# Altium schematic sheet blocks.SchDoc
size A3; Email: soliva@seaos.co.jp; Rule: PcbType=ProtelPcb
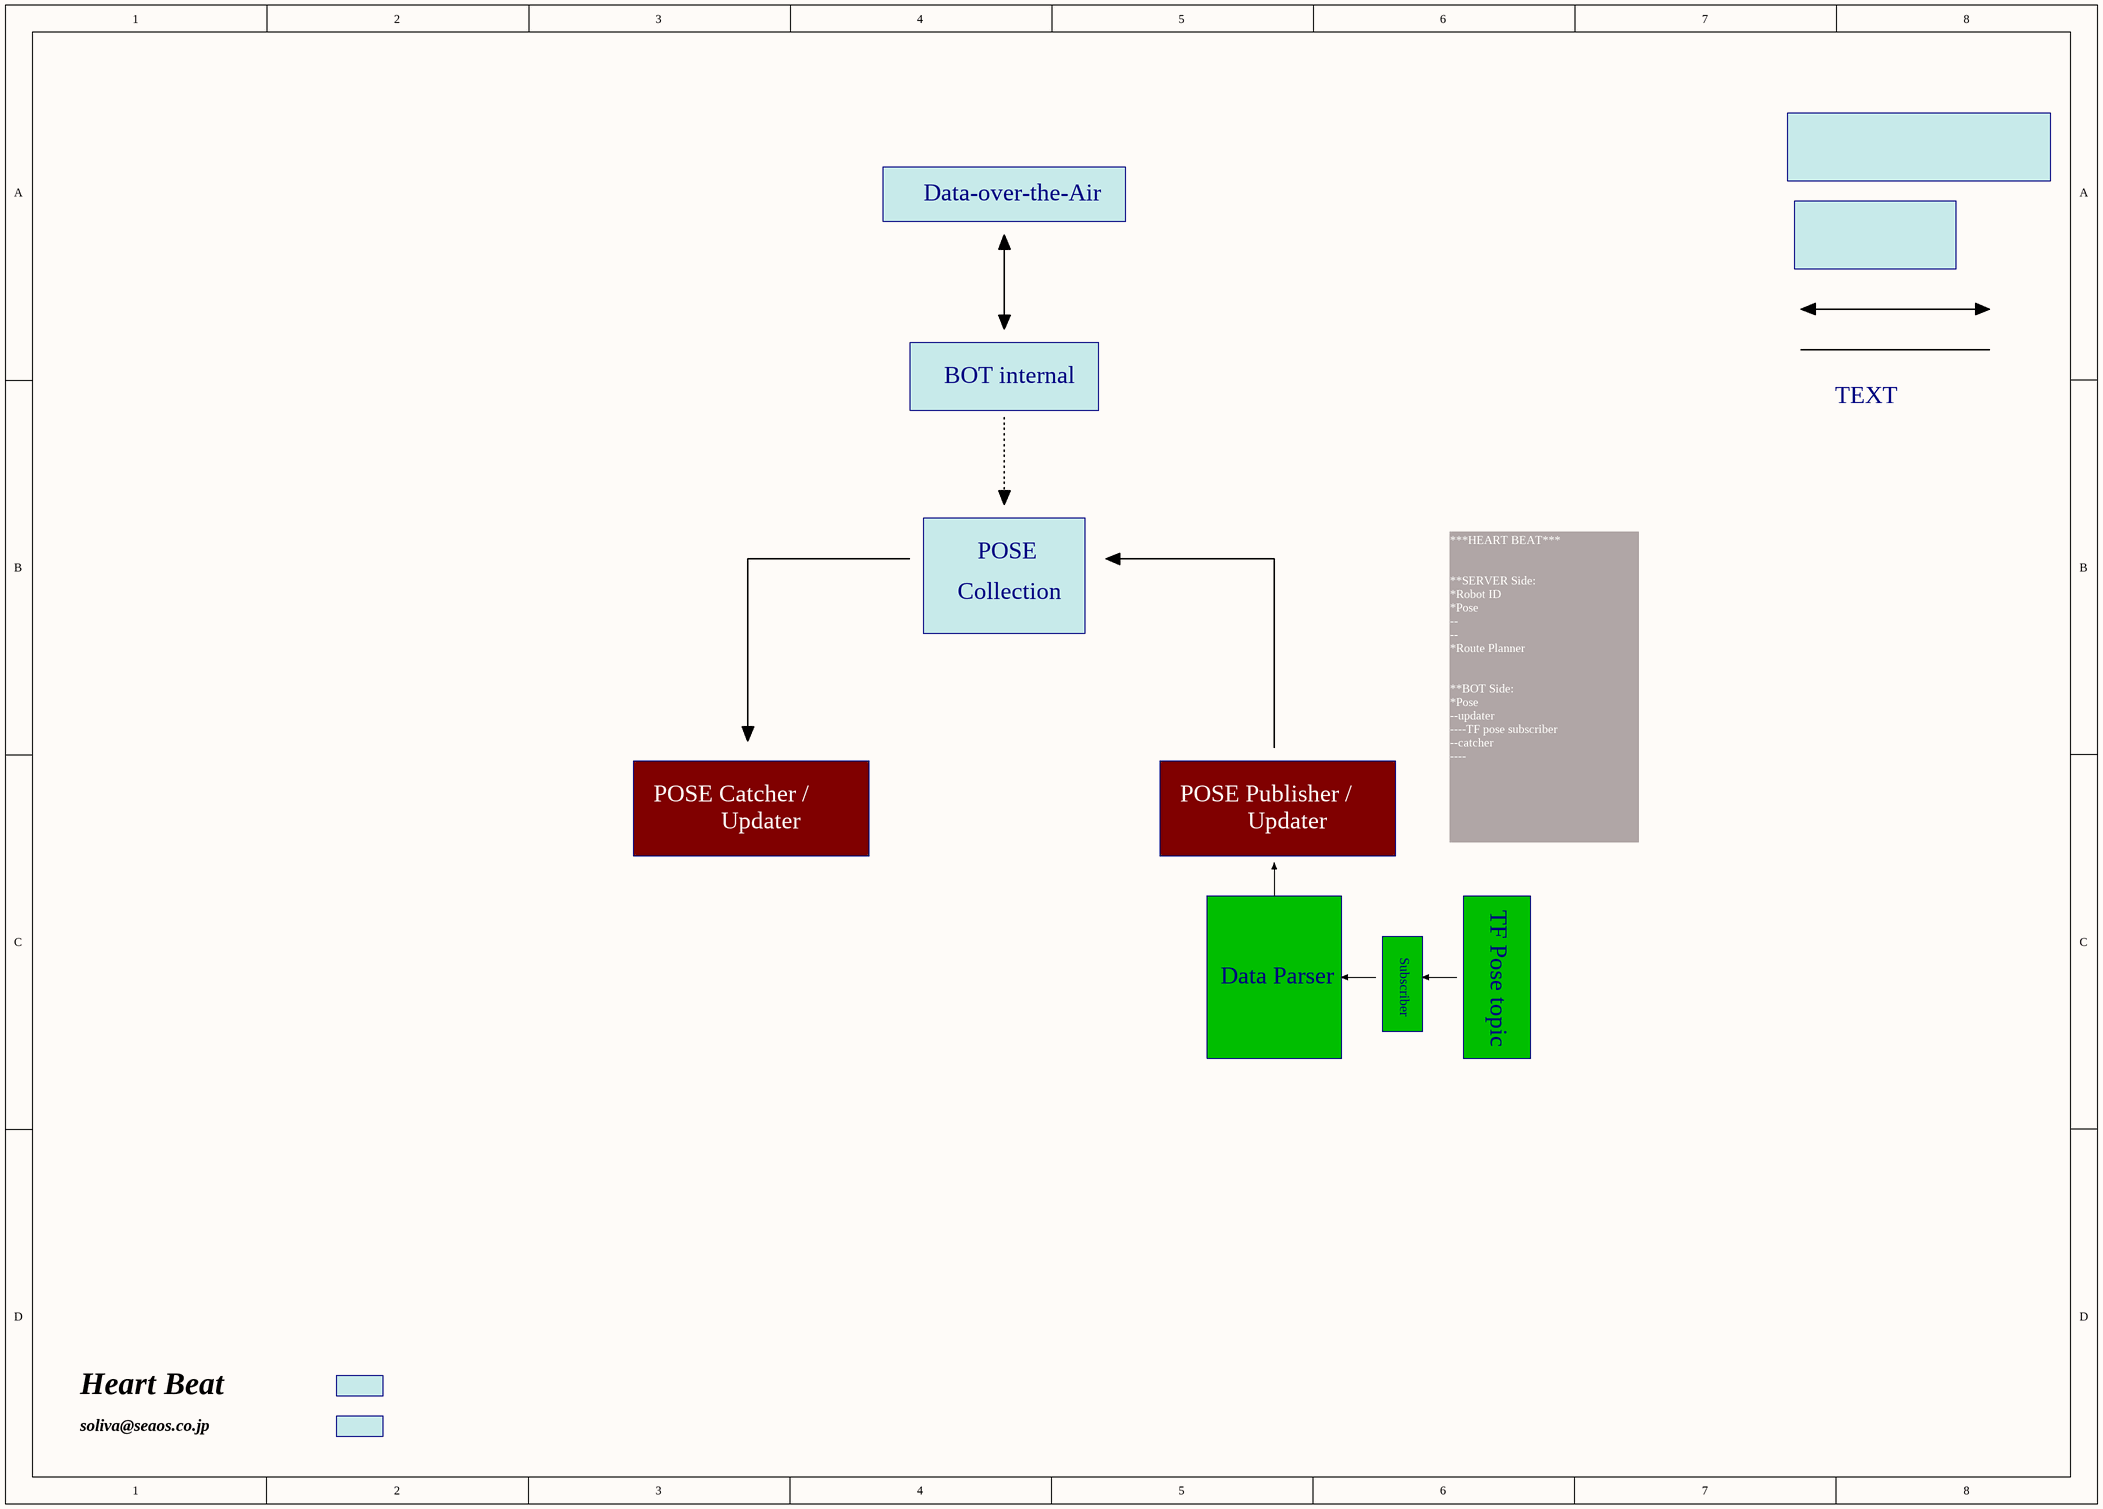
[diagram p0: blocks.SchDoc]

## Notes on the sheet
- Data-over-the-Air
- BOT internal
- TEXT
- POSE
- Collection
- POSE Catcher /
- Updater
- POSE Publisher /
- ***HEART BEAT***
  **SERVER Side:
  *Robot ID
  *Pose
  --
  --
  *Route Planner
  **BOT Side:
  *Pose
  --updater
  ----TF pose subscriber
  --catcher
  ----
- TF Pose topic
- Data Parser
- Subscriber
- Heart Beat
- soliva@seaos.co.jp